# Altium schematic sheet 0_architecture.SchDoc: Poject's info and block diagram
size A4; Organization: UFSC; DocumentNumber: 1; SheetNumber: 1; SheetTotal: 2
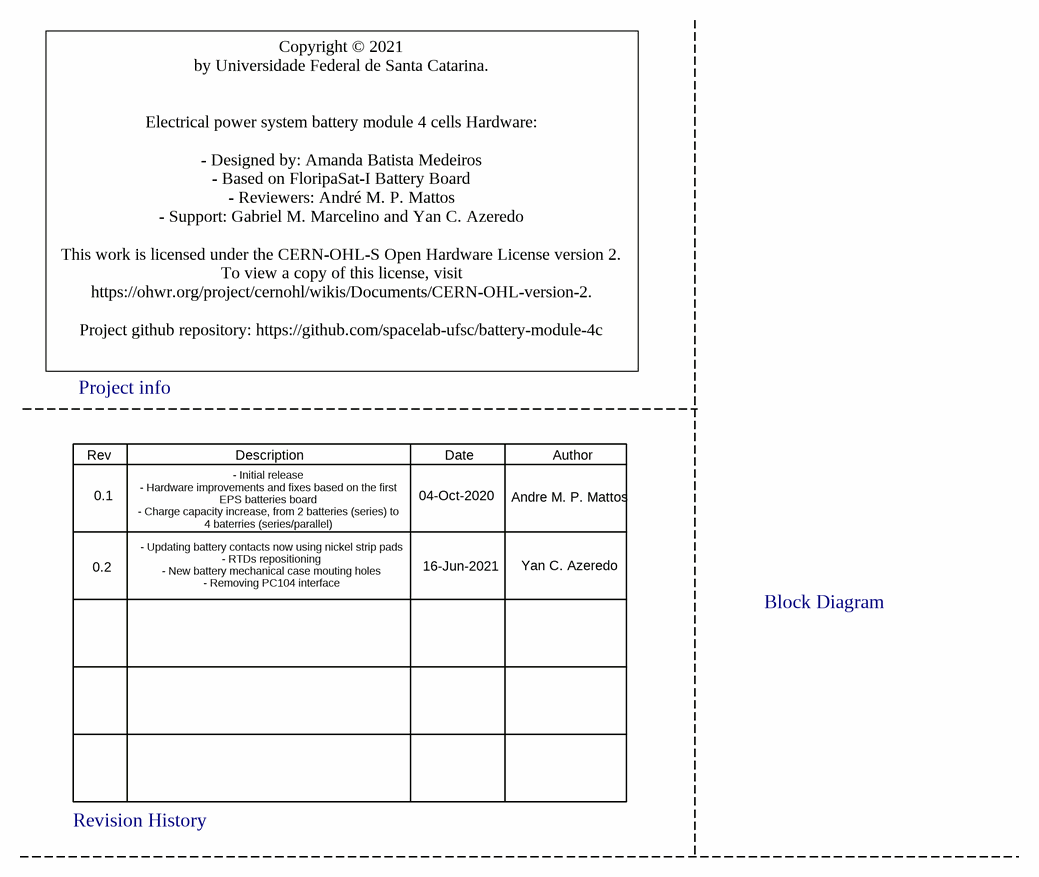
[diagram p0: 0_architecture.SchDoc]

## Notes on the sheet
- Copyright © 2021
  by Universidade Federal de Santa Catarina.
  Electrical power system battery module 4 cells Hardware:
  - Designed by: Amanda Batista Medeiros
  - Based on FloripaSat-I Battery Board
  - Reviewers: André M. P. Mattos
  - Support: Gabriel M. Marcelino and Yan C. Azeredo
  This work is licensed under the CERN-OHL-S Open Hardware License version 2.
  To view a copy of this license, visit https://ohwr.org/project/cernohl/wikis/Documents/CERN-OHL-version-2.
  Project github repository: https://github.com/spacelab-ufsc/battery-module-4c
- Project info
- Rev
- 0.1
- Description
- 04-Oct-2020
- Date
- Andre M. P. Mattos
- Author
- 0.2
- - Initial release
  - Hardware improvements and fixes based on the first EPS batteries board
  - Charge capacity increase, from 2 batteries (series) to 4 baterries (series/parallel)
- 16-Jun-2021
- Yan C. Azeredo
- - Updating battery contacts now using nickel strip pads
  - RTDs repositioning
  - New battery mechanical case mouting holes
  - Removing PC104 interface
- Block Diagram
- Revision History
- Project:
- SpaceLab - Federal University of Santa Catarina
- Title:
- Designed by:
- Project Code:
- Date:
- Revision:
- Sheet
- of
- Size:
- A4